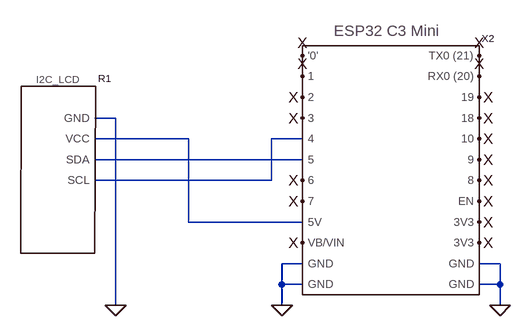
[diagram p0: schematic receiver.asc]
receiver.asc, the LTspice schematic file:
Version 4.1
SHEET 1 880 680
WIRE -224 112 -256 112
WIRE -112 144 -256 144
WIRE 64 144 16 144
WIRE 64 176 -256 176
WIRE 16 208 16 144
WIRE 16 208 -256 208
WIRE -112 272 -112 144
WIRE 64 272 -112 272
WIRE 64 336 32 336
WIRE 368 336 336 336
WIRE 32 368 32 336
WIRE 64 368 32 368
WIRE 368 368 368 336
WIRE 368 368 336 368
WIRE -224 400 -224 112
WIRE 32 400 32 368
WIRE 368 400 368 368
FLAG -224 400 0
FLAG 32 400 0
FLAG 368 400 0
FLAG 64 304 X
FLAG 64 208 X
FLAG 64 240 X
FLAG 64 112 X
FLAG 64 80 X
FLAG 64 48 X
FLAG 64 16 X
FLAG 336 16 X
FLAG 336 48 X
FLAG 336 80 X
FLAG 336 112 X
FLAG 336 144 X
FLAG 336 176 X
FLAG 336 208 X
FLAG 336 240 X
FLAG 336 272 X
FLAG 336 304 X
SYMBOL symbols\\I2C_LCD -176 192 R0
SYMATTR InstName R1
SYMBOL symbols\\esp32_c3_mini 112 80 R0
SYMATTR InstName X2

The netlist it stands for:
* receiver.asc
R1 N001 N003 N002 0
X§X2 X X X X N002 N003 X X N001 X 0 0 X X X X X X X X X X 0 0 esp32_c3_mini  ; pins '0' 1 2 3 4 5 6 7 5V VB/VIN GND GND TX0_(21) RX0_(20) 19 18 10 9 8 EN 3V3 3V3 GND GND
.backanno
.end